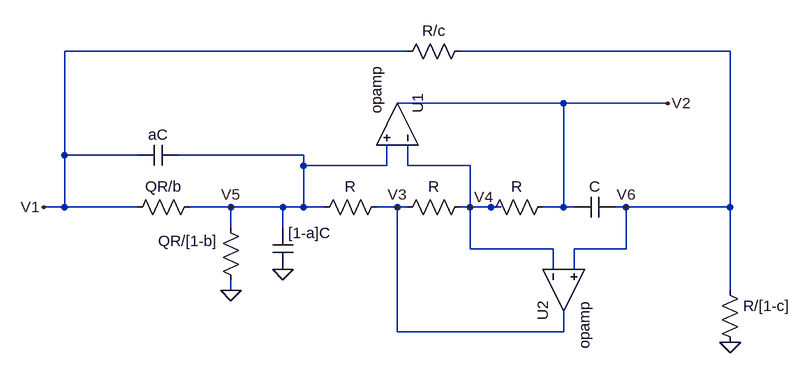
[diagram p0: schematic bicuad2.asc]
bicuad2.asc, the LTspice schematic file:
Version 4
SHEET 1 1156 680
WIRE 304 -112 -224 -112
WIRE 800 -112 384 -112
WIRE 544 -32 288 -32
WIRE 704 -32 544 -32
WIRE -224 48 -224 -112
WIRE -112 48 -224 48
WIRE 144 48 -48 48
WIRE 144 64 144 48
WIRE 272 64 272 32
WIRE 272 64 144 64
WIRE 304 64 304 32
WIRE 400 64 304 64
WIRE -224 128 -224 48
WIRE -224 128 -256 128
WIRE -112 128 -224 128
WIRE 32 128 -32 128
WIRE 112 128 32 128
WIRE 144 128 144 64
WIRE 144 128 112 128
WIRE 176 128 144 128
WIRE 288 128 256 128
WIRE 304 128 288 128
WIRE 400 128 400 64
WIRE 400 128 384 128
WIRE 432 128 400 128
WIRE 448 128 432 128
WIRE 544 128 544 -32
WIRE 544 128 512 128
WIRE 560 128 544 128
WIRE 640 128 624 128
WIRE 800 128 800 -112
WIRE 800 128 640 128
WIRE 32 160 32 128
WIRE 112 160 112 128
WIRE 400 192 400 128
WIRE 528 192 400 192
WIRE 640 192 640 128
WIRE 640 192 560 192
WIRE 528 224 528 192
WIRE 560 224 560 192
WIRE 32 256 32 240
WIRE 800 256 800 128
WIRE 288 320 288 128
WIRE 544 320 544 288
WIRE 544 320 288 320
FLAG 32 256 0
FLAG -256 128 V1
FLAG 800 336 0
FLAG 112 224 0
FLAG 32 128 V5
FLAG 288 128 V3
FLAG 400 128 V4
FLAG 704 -32 V2
FLAG 640 128 V6
SYMBOL cap -48 32 R90
WINDOW 0 0 32 VBottom 2
WINDOW 3 32 32 VTop 2
SYMATTR InstName aC
SYMATTR Value ""
SYMBOL res 48 256 R180
WINDOW 0 36 76 Left 2
WINDOW 3 36 40 Left 2
SYMATTR InstName QR/[1-b]
SYMATTR Value ""
SYMBOL res 272 112 R90
WINDOW 0 0 56 VBottom 2
WINDOW 3 32 56 VTop 2
SYMATTR InstName R
SYMATTR Value ""
SYMBOL res 400 112 R90
WINDOW 0 0 56 VBottom 2
WINDOW 3 32 56 VTop 2
SYMATTR InstName R
SYMATTR Value ""
SYMBOL res 528 112 R90
WINDOW 0 0 56 VBottom 2
WINDOW 3 32 56 VTop 2
SYMATTR InstName R
SYMATTR Value ""
SYMBOL cap 624 112 R90
WINDOW 0 0 32 VBottom 2
WINDOW 3 32 32 VTop 2
SYMATTR InstName C
SYMATTR Value ""
SYMBOL OpAmps\\opamp 352 0 M270
SYMATTR InstName U1
SYMBOL OpAmps\\opamp 480 256 M90
SYMATTR InstName U2
SYMBOL res 400 -128 R90
WINDOW 0 0 56 VBottom 2
WINDOW 3 32 56 VTop 2
SYMATTR InstName R/c
SYMATTR Value ""
SYMBOL res 784 240 R0
SYMATTR InstName R/[1-c]
SYMATTR Value ""
SYMBOL cap 96 160 R0
SYMATTR InstName [1-a]C
SYMATTR Value ""
SYMBOL res -16 112 R90
WINDOW 0 0 56 VBottom 2
WINDOW 3 32 56 VTop 2
SYMATTR InstName QR/b
SYMATTR Value ""

The netlist it stands for:
* bicuad2.asc
C§aC V5 V1
R§QR/[1-b] 0 V5
R V3 V5
R V4 V3
R V2 V4
C V6 V2
XU1 V4 V5 V2 opamp Aol=100K GBW=10Meg  ; pins invin noninvin out
XU2 V4 V6 V3 opamp Aol=100K GBW=10Meg  ; pins invin noninvin out
R/c V6 V1
R/[1-c] V6 0
C§[1-a]C V5 0
R§QR/b V5 V1
.backanno
.end